# Altium schematic sheet LEDs.SchDoc
size A4
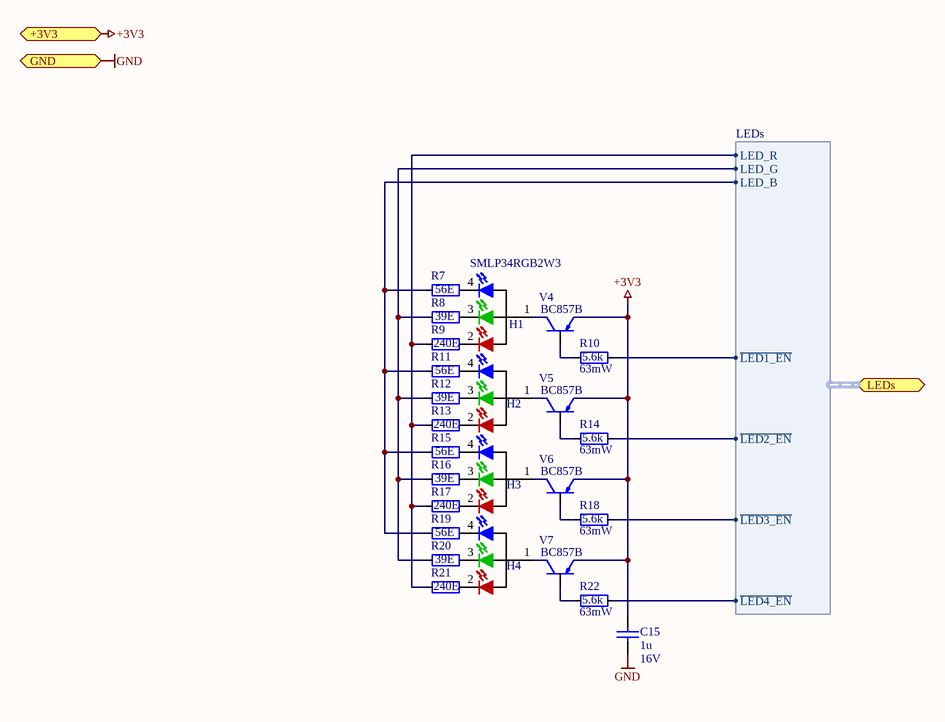
[diagram p0: LEDs.SchDoc]

## Parts
C15  value 1u  Value2: 16V  [SMD_CAP_0603]  (hidden comment: C_SMD_CER_1U_16V_10%_X7R_0603)
H1  Type: SMLP34RGB2W3  [SMD_LED_0404]  (hidden comment: H_SMD_LED_RGB_DIFFUSED_5MA_0404)
H2  H_SMD_LED_RGB_DIFFUSED_5MA_0404  [SMD_LED_0404]  (value not drawn)
H3  H_SMD_LED_RGB_DIFFUSED_5MA_0404  [SMD_LED_0404]  (value not drawn)
H4  H_SMD_LED_RGB_DIFFUSED_5MA_0404  [SMD_LED_0404]  (value not drawn)
R7  value 56E  [SMD_RES_0402]  (hidden comment: R_SMD_THINFILM_56E_0W063_0%5_50PPM_0402)
R8  value 39E  [SMD_RES_0402]  (hidden comment: R_SMD_THINFILM_39E_0W063_0%5_50PPM_0402)
R9  value 240E  [SMD_RES_0402]  (hidden comment: R_SMD_THINFILM_240E_0W063_0%5_25PPM_0402)
R10  value 5.6k  Value2: 63mW  [SMD_RES_0402]  (hidden comment: R_SMD_THINFILM_5K6_0W063_0%5_25PPM_0402)
R11  value 56E  [SMD_RES_0402]  (hidden comment: R_SMD_THINFILM_56E_0W063_0%5_50PPM_0402)
R12  value 39E  [SMD_RES_0402]  (hidden comment: R_SMD_THINFILM_39E_0W063_0%5_50PPM_0402)
R13  value 240E  [SMD_RES_0402]  (hidden comment: R_SMD_THINFILM_240E_0W063_0%5_25PPM_0402)
R14  value 5.6k  Value2: 63mW  [SMD_RES_0402]  (hidden comment: R_SMD_THINFILM_5K6_0W063_0%5_25PPM_0402)
R15  value 56E  [SMD_RES_0402]  (hidden comment: R_SMD_THINFILM_56E_0W063_0%5_50PPM_0402)
R16  value 39E  [SMD_RES_0402]  (hidden comment: R_SMD_THINFILM_39E_0W063_0%5_50PPM_0402)
R17  value 240E  [SMD_RES_0402]  (hidden comment: R_SMD_THINFILM_240E_0W063_0%5_25PPM_0402)
R18  value 5.6k  Value2: 63mW  [SMD_RES_0402]  (hidden comment: R_SMD_THINFILM_5K6_0W063_0%5_25PPM_0402)
R19  value 56E  [SMD_RES_0402]  (hidden comment: R_SMD_THINFILM_56E_0W063_0%5_50PPM_0402)
R20  value 39E  [SMD_RES_0402]  (hidden comment: R_SMD_THINFILM_39E_0W063_0%5_50PPM_0402)
R21  value 240E  [SMD_RES_0402]  (hidden comment: R_SMD_THINFILM_240E_0W063_0%5_25PPM_0402)
R22  value 5.6k  Value2: 63mW  [SMD_RES_0402]  (hidden comment: R_SMD_THINFILM_5K6_0W063_0%5_25PPM_0402)
V4  Type: BC857B  [SMD_SOT_23_3]  (hidden comment: V_SMD_TRANS_PNP_BC857B_45V_0A1_SOT-23-3)
V5  Type: BC857B  [SMD_SOT_23_3]  (hidden comment: V_SMD_TRANS_PNP_BC857B_45V_0A1_SOT-23-3)
V6  Type: BC857B  [SMD_SOT_23_3]  (hidden comment: V_SMD_TRANS_PNP_BC857B_45V_0A1_SOT-23-3)
V7  Type: BC857B  [SMD_SOT_23_3]  (hidden comment: V_SMD_TRANS_PNP_BC857B_45V_0A1_SOT-23-3)

## Ports
+3V3, GND, LEDs (harness LEDs)

## Harnesses
LEDs: ~{LED1_EN}, ~{LED2_EN}, ~{LED3_EN}, ~{LED4_EN}, LED_B, LED_G, LED_R

## Nets
+3V3: C15.2 V4.2(E) V5.2(E) V6.2(E) V7.2(E) ; port +3V3
GND: C15.1 ; port GND
NetH1_1: H1.1 V4.3(C)
NetH1_2: H1.2 R9.2
NetH1_3: H1.3 R8.2
NetH1_4: H1.4 R7.2
NetH2_1: H2.1 V5.3(C)
NetH2_2: H2.2 R13.2
NetH2_3: H2.3 R12.2
NetH2_4: H2.4 R11.2
NetH3_1: H3.1 V6.3(C)
NetH3_2: H3.2 R17.2
NetH3_3: H3.3 R16.2
NetH3_4: H3.4 R15.2
NetH4_1: H4.1 V7.3(C)
NetH4_2: H4.2 R21.2
NetH4_3: H4.3 R20.2
NetH4_4: H4.4 R19.2
NetR7_1: R7.1 R11.1 R15.1 R19.1 ; port LEDs.LED_B
NetR8_1: R8.1 R12.1 R16.1 R20.1 ; port LEDs.LED_G
NetR9_1: R9.1 R13.1 R17.1 R21.1 ; port LEDs.LED_R
NetR10_1: R10.1 V4.1(B)
NetR10_2: R10.2 ; port LEDs.~{LED1_EN}
NetR14_1: R14.1 V5.1(B)
NetR14_2: R14.2 ; port LEDs.~{LED2_EN}
NetR18_1: R18.1 V6.1(B)
NetR18_2: R18.2 ; port LEDs.~{LED3_EN}
NetR22_1: R22.1 V7.1(B)
NetR22_2: R22.2 ; port LEDs.~{LED4_EN}

## Notes on the sheet
- Title
- Size:
- Date:
- A4
- Number:
- Time:
- Revision:
- Sheet
- of
- File:

## Library data of the parts
C15 = C_SMD_CER_1U_16V_10%_X7R_0603: 1µF ±10% 16V Ceramic Capacitor X7R 0603 (1608 Metric); Supplier - Digikey: 1276-1019-1-ND
H1-H4 = H_SMD_LED_RGB_DIFFUSED_5MA_0404: Red, Green, Blue (RGB) 624nm Red, 527nm Green, 470nm Blue LED Indication - Discrete 2.1V Red, 3.1V Green, 3V Blue 0404 (1010 Metric); Supplier - Digikey: SMLP34RGB2W3CT-ND
R7 R11 R15 R19 = R_SMD_THINFILM_56E_0W063_0%5_50PPM_0402: 56 Ohms ±0.5% 0.063W, 1/16W Chip Resistor 0402 (1005 Metric) Thin Film; Supplier - Digikey: 311-56UCT-ND
R8 R12 R16 R20 = R_SMD_THINFILM_39E_0W063_0%5_50PPM_0402: 39 Ohms ±0.5% 0.063W, 1/16W Chip Resistor 0402 (1005 Metric) Thin Film; Supplier - Digikey: 311-39UCT-ND
R9 R13 R17 R21 = R_SMD_THINFILM_240E_0W063_0%5_25PPM_0402: 240 Ohms ±0.5% 0.063W, 1/16W Chip Resistor 0402 (1005 Metric) Automotive AEC-Q200 Thin Film; Supplier - Digikey: P240DECT-ND
R10 R14 R18 R22 = R_SMD_THINFILM_5K6_0W063_0%5_25PPM_0402: 5.6 kOhms ±0.5% 0.063W, 1/16W Chip Resistor 0402 (1005 Metric) Automotive AEC-Q200 Thin Film; Supplier - Digikey: RNCF0402DTE5K60CT-ND
V4-V7 = V_SMD_TRANS_PNP_BC857B_45V_0A1_SOT-23-3: SMD PNP Transistor BC857B 100mA 45V; Supplier - Digikey: BC857BLT3GOSCT-ND